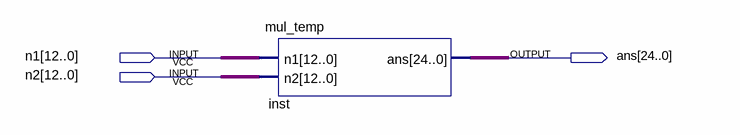
[diagram p0: schematic sheet]
// Quartus schematic TEST_IAN.bdf as structural Verilog: 1 symbols, 3 pins
module TEST_IAN (
  input  [12:0] n1,
  input  [12:0] n2,
  output [24:0] ans
);

  mul_temp inst (.n1(n1), .n2(n2), .ans(ans));
endmodule
